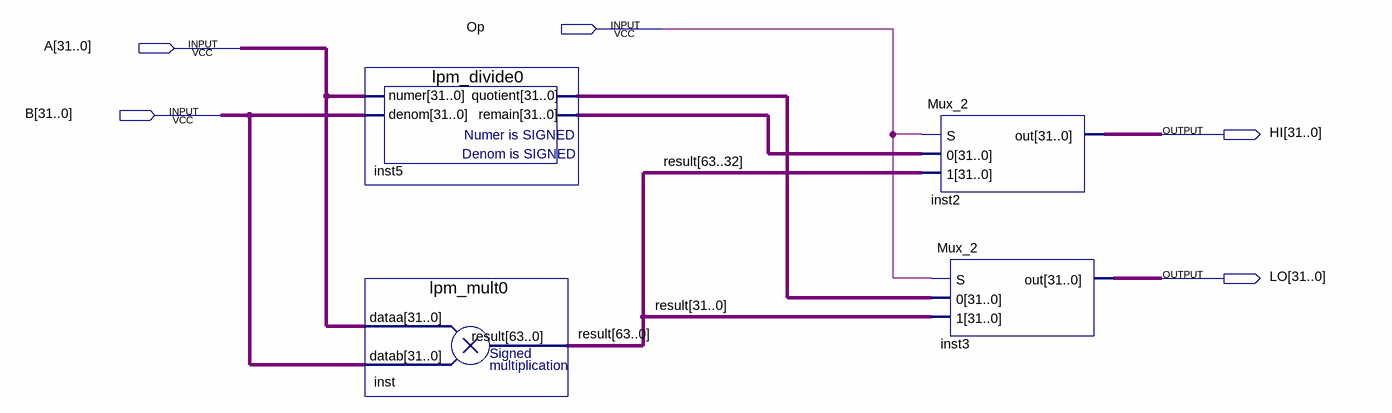
[diagram p0: schematic sheet]
// Quartus schematic Coprocessador_Arithmetic_Unit.bdf as structural Verilog: 4 symbols, 5 pins
module Coprocessador_Arithmetic_Unit (
  input  Op,
  input  [31:0] A,
  input  [31:0] B,
  output [31:0] HI,
  output [31:0] LO
);

  wire [31:0] inst5_quotient, inst5_remain;
  wire [63:0] result;

  lpm_divide0 inst5 (.numer(A), .denom(B), .quotient(inst5_quotient), .remain(inst5_remain));
  lpm_mult0 inst (.dataa(A), .datab(B), .result(result));
  Mux_2 inst2 (.S(Op), .\0 (inst5_remain), .\1 (result[63:32]), .out(HI));
  Mux_2 inst3 (.S(Op), .\0 (inst5_quotient), .\1 (result[31:0]), .out(LO));
endmodule
